# Altium schematic sheet BaiDoXe_CamBien.SchDoc
size A
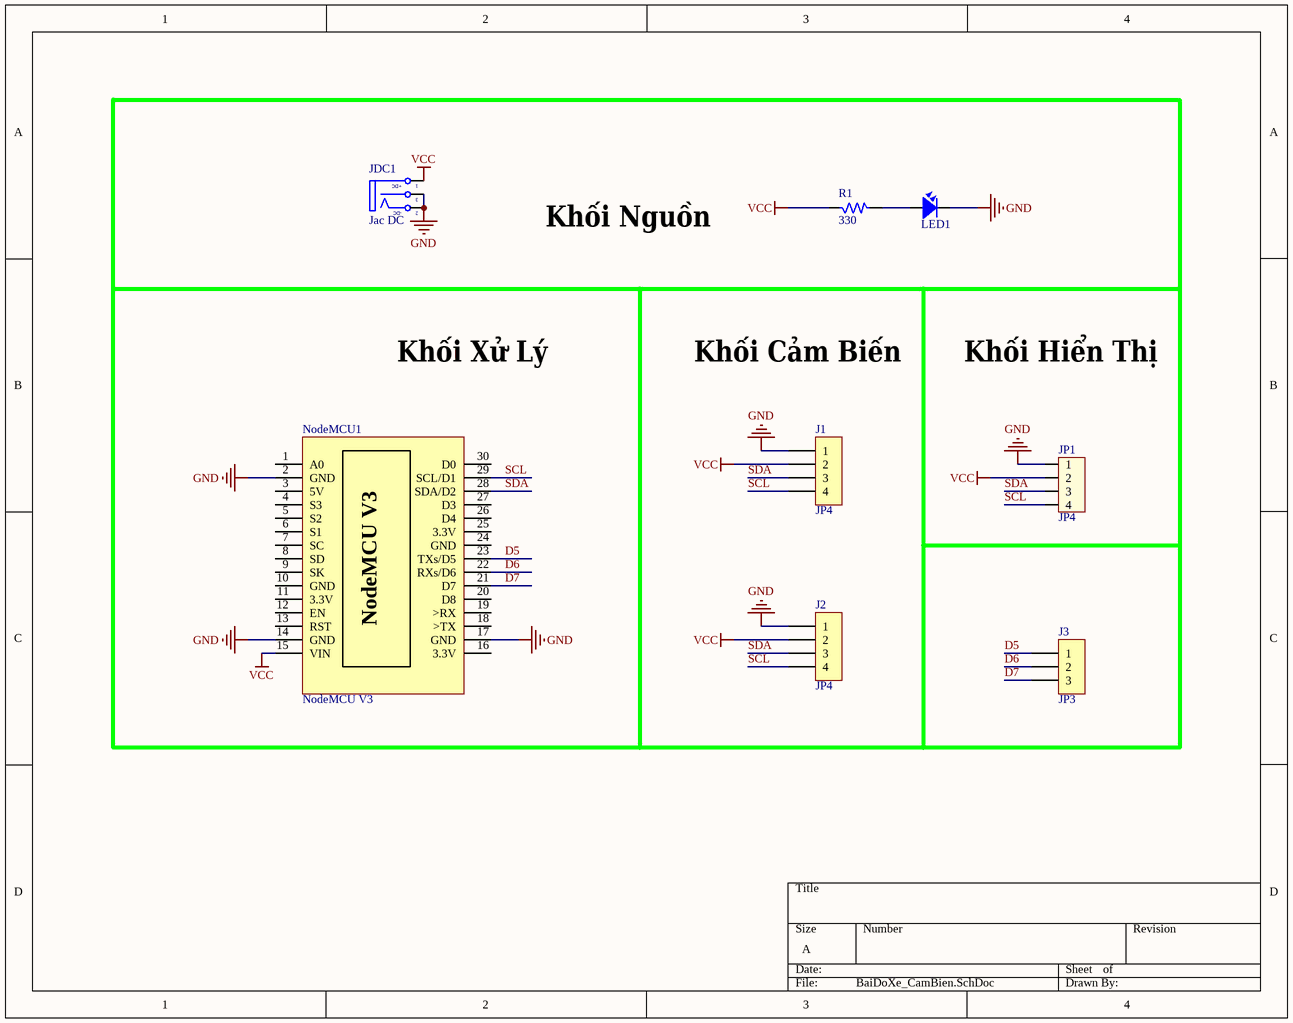
[diagram p0: BaiDoXe_CamBien.SchDoc]

## Parts
J1  JP4  [JUMP DON 4]
J2  JP4  [JUMP DON 4]
J3  JP3  [JUMP DON 3]
JDC1  Jac DC  [DC-IN]
JP1  JP4  [CON4]
LED1  LED  [LED-5-BLUE]  (value not drawn)
NodeMCU1  NodeMCU V3  [NodeMCU-V3]
R1  330  [res_0805]

## Nets
GND: J1.1 J2.1 JDC1.2(TN) JDC1.3(S) JP1.1 LED1.2 NodeMCU1.2(GND) NodeMCU1.14(GND) NodeMCU1.17(GND)
VCC: J1.2 J2.2 JDC1.1(T) JP1.2 NodeMCU1.15(VIN) R1.1
D5: J3.1 NodeMCU1.23(TXs/D5)
D6: J3.2 NodeMCU1.22(RXs/D6)
D7: J3.3 NodeMCU1.21(D7)
SCL: J1.4 J2.4 JP1.4 NodeMCU1.29(SCL/D1)
SDA: J1.3 J2.3 JP1.3 NodeMCU1.28(SDA/D2)
NetLED1_1: LED1.1 R1.2

Not connected (* = marked no-connect by the designer): NodeMCU1 1(A0) 3(5V) 4(S3) 5(S2) 6(S1) 7(SC) 8(SD) 9(SK) 10(GND) 11(3.3V) 12(EN) 13(RST) 16(3.3V) 18(>TX) 19(>RX) 20(D8) 24(GND) 25(3.3V) 26(D4) 27(D3) 30(D0)

## Notes on the sheet
- Khối Nguồn
- Khối Xử Lý
- Khối Cảm Biến
- Khối Hiển Thị
- (in symbol DCIN) +DC; -DC

## Library data of the parts
J1 J2 = JUMP 4: JUMP DON DUC 2.54
J3 = JUMP 3: JUMP DON DUC 2.54
JDC1 = DCIN: Jac DC input; Value: Jac DC
JP1 = Con4: Connector 4; Value: Connector 4
LED1 = LED: LED Single colour Green and Red; Value: LED 3 ly Single Colour
NodeMCU1 = NodeMCU-V3
R1 = RES 0805: TRO DAN 0805; Value: R1/4W - 1K